# EAGLE schematic ethernet chip (EAGLE 7.4.0)
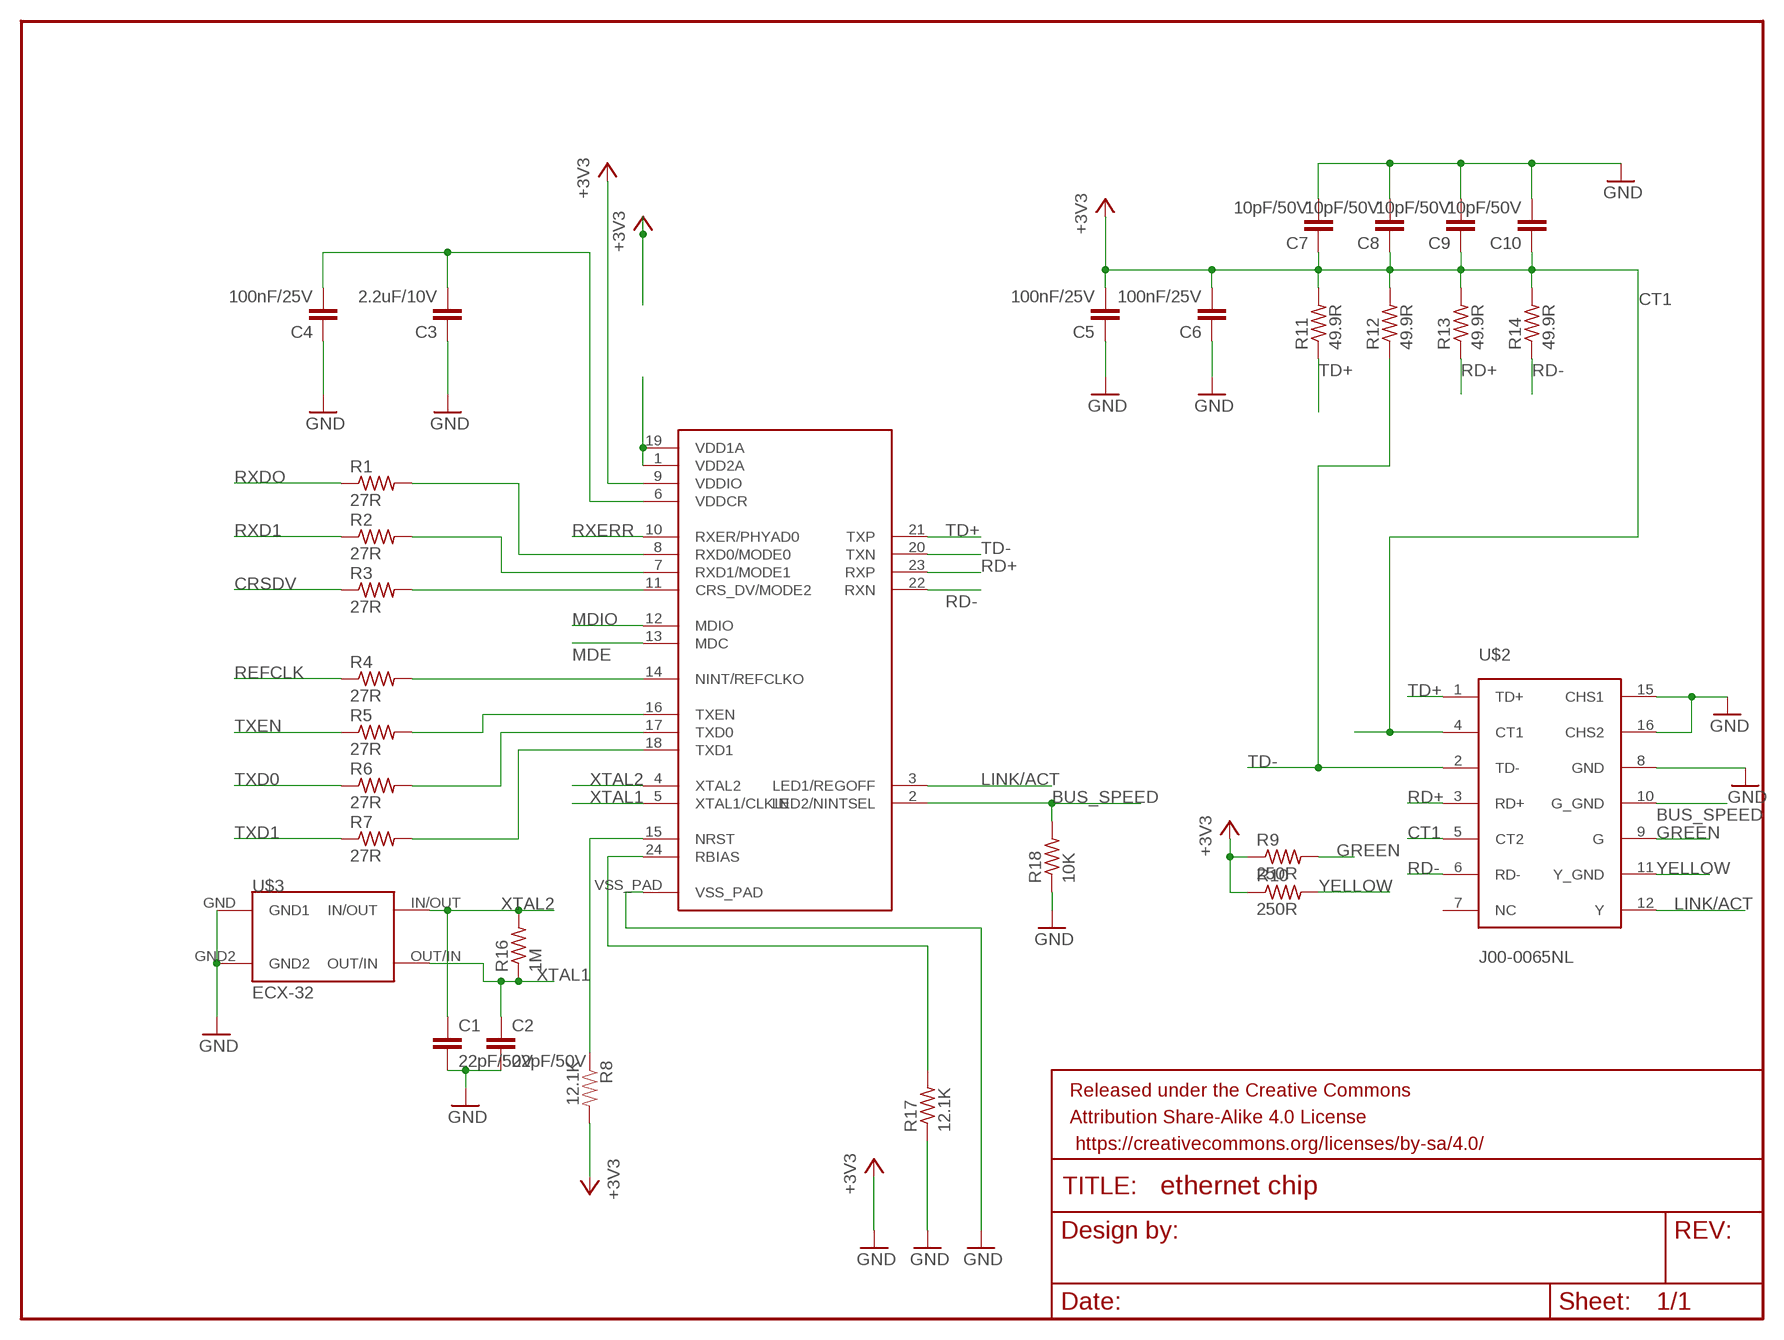
[diagram p0: schematic, sheet 1]

## Parts
C1  22pF/50V  CC0603  [C0603]
C2  22pF/50V  CC0603  [C0603]
C3  2.2uF/10V  CC0603  [C0603]
C4  100nF/25V  CC0603  [C0603]
C5  100nF/25V  CC0603  [C0603]
C6  100nF/25V  CC0603  [C0603]
C7  10pF/50V  CC0603  [C0603]
C8  10pF/50V  CC0603  [C0603]
C9  10pF/50V  CC0603  [C0603]
C10  10pF/50V  CC0603  [C0603]
FRAME1  FRAME-LETTER  [CREATIVE_COMMONS]
R1  27R  R-US_R0603  [R0603]
R2  27R  R-US_R0603  [R0603]
R3  27R  R-US_R0603  [R0603]
R4  27R  R-US_R0603  [R0603]
R5  27R  R-US_R0603  [R0603]
R6  27R  R-US_R0603  [R0603]
R7  27R  R-US_R0603  [R0603]
R8  12.1K  RESISTOR0603-RES  [0603-RES]
R9  250R  R-US_R0603  [R0603]
R10  250R  R-US_R0603  [R0603]
R11  49.9R  R-US_R0603  [R0603]
R12  49.9R  R-US_R0603  [R0603]
R13  49.9R  R-US_R0603  [R0603]
R14  49.9R  R-US_R0603  [R0603]
R16  1M  R-US_R0603  [R0603]
R17  12.1K  R-US_R0603  [R0603]
R18  10K  R-US_R0603  [R0603]
U$1  LAN8720LAN8720  [24-QFN]
U$2  J00-0065NL  [J00-0065NL]
U$3  ECX-32  [ECX-32]

## Nets
+3V3: R8.2 R9.1 R10.1 U$1.9(VDDIO) ; supply symbol labelled GND
BUS_SPEED: R18.2 U$1.2(LED2/NINTSEL) U$2.10(G_GND)
CRSDV: R3.1
CT1: C5.2 C6.2 C7.1 C8.1 C9.1 C10.1 R11.2 R12.2 R13.2 R14.2 U$2.4(CT1) U$2.5(CT2) ; supply symbol labelled +3V3
GND: C1.2 C2.2 C3.1 C4.1 C5.1 C6.1 C7.2 C8.2 C9.2 C10.2 R17.1 R18.1 U$1.VSS_PAD U$2.8(GND) U$2.15(CHS1) U$2.16(CHS2) U$3.GND2 U$3.GND(GND1)
GREEN: R9.2 U$2.9(G)
LINK/ACT: U$1.3(LED1/REGOFF) U$2.12(Y)
MDE: U$1.13(MDC)
MDIO: U$1.12(MDIO)
N$1: R1.2 U$1.8(RXD0/MODE0)
N$2: R2.2 U$1.7(RXD1/MODE1)
N$3: C3.2 C4.2 U$1.6(VDDCR)
N$4: R17.2 U$1.24(RBIAS)
N$5: R3.2 U$1.11(CRS_DV/MODE2)
N$7: R4.2 U$1.14(NINT/REFCLKO)
N$8: R5.2 U$1.16(TXEN)
N$9: R6.2 U$1.17(TXD0)
N$10: R7.2 U$1.18(TXD1)
N$11: U$1.1(VDD2A) U$1.19(VDD1A)
N$14: R8.1 U$1.15(NRST)
RD+: R13.1 U$1.23(RXP) U$2.3(RD+)
RD-: R14.1 U$1.22(RXN) U$2.6(RD-)
REFCLK: R4.1
RXD1: R2.1
RXDO: R1.1
RXERR: U$1.10(RXER/PHYAD0)
TD+: R11.1 U$1.21(TXP) U$2.1(TD+)
TD-: R12.1 U$1.20(TXN) U$2.2(TD-)
TXD0: R6.1
TXD1: R7.1
TXEN: R5.1
XTAL1: C2.1 R16.1 U$1.5(XTAL1/CLKIN) U$3.OUT/IN
XTAL2: C1.1 R16.2 U$1.4(XTAL2) U$3.IN/OUT
YELLOW: R10.2 U$2.11(Y_GND)
Unconnected: U$2.7(NC)

## Library data of the parts
C1-C10 = eagle-ltspice:C: CAPACITOR, European symbol; SPICEMODEL: NONE; SPICEPREFIX: C
FRAME1 = SparkFun-Aesthetics:FRAME-LETTER: Schematic Frame Standard 8.5x11 US Letter frame
R1-R7 R9-R14 R16-R18 = resistor:R-US_: RESISTOR, American symbol
R8 = SparkFun-Passives:RESISTOR: Resistor Basic schematic elements and footprints for 0603, 1206, and PTH resistors.
U$1 = Luke:LAN8720
U$2 = Paul's Library:J00-0065NL: Ethernet port device.
U$3 = Other:ECX-32